# EAGLE design PentaBlinky (EAGLE 7.5.0)
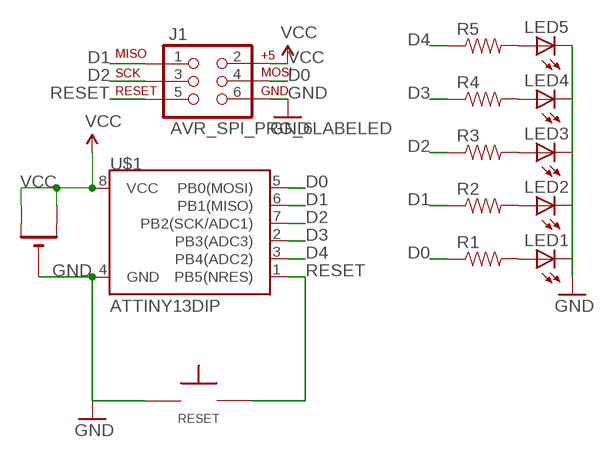
[diagram p0: schematic, sheet 1]

## Parts
J1  AVR_SPI_PRG_6LABELED  [2X3-NS]
LED1  LED5MM  [LED5MM]
LED2  LED5MM  [LED5MM]
LED3  LED5MM  [LED5MM]
LED4  LED5MM  [LED5MM]
LED5  LED5MM  [LED5MM]
R1  RESISTORAXIAL-0.3  [AXIAL-0.3]
R2  RESISTORAXIAL-0.3  [AXIAL-0.3]
R3  RESISTORAXIAL-0.3  [AXIAL-0.3]
R4  RESISTORAXIAL-0.3  [AXIAL-0.3]
R5  RESISTORAXIAL-0.3  [AXIAL-0.3]
RESET  SPST_NO  TAC_SPST_NO  [TAC_SPST_NO]
U$1  ATTINY13DIP  [DIP08]
U$4  BATT_GEN  [AA-AAA]

## Nets
D0: J1.4(MOSI) R1.P$1 U$1.5(PB0(MOSI))
D1: J1.1(MISO) R2.P$1 U$1.6(PB1(MISO))
D2: J1.3(SCK) R3.P$1 U$1.7(PB2(SCK/ADC1))
D3: R4.P$1 U$1.2(PB3(ADC3))
D4: R5.P$1 U$1.3(PB4(ADC2))
GND: J1.6(GND) LED1.K(C) LED2.K(C) LED3.K(C) LED4.K(C) LED5.K(C) RESET.P$1 U$1.4(GND) U$4.-
N$1: LED1.A R1.P$2
N$2: LED2.A R2.P$2
N$3: LED3.A R3.P$2
N$4: LED4.A R4.P$2
N$5: LED5.A R5.P$2
RESET: J1.5(RST) RESET.P$2 U$1.1(PB5(NRES))
VCC: J1.2(V+) U$1.8(VCC) U$4.+ U$4.++(+1)

## Library data of the parts
J1 = barbary_enterprises:AVR_SPI_PRG_6: AVR ISP 6 Pin This is the reduced ISP connector for AVR programming. Common on Arduino. This footprint will take up less PCB space and can be used with a 10-pin to 6-pin adapter such as SKU: BOB-08508
LED1-LED5 = SparkFun-LED:LED: LEDs Standard schematic elements and footprints for 5mm, 3mm, 1206, and 0603 sized LEDs. 5mm - Spark Fun Electronics SKU : COM-00529 (and others)
R1-R5 = SparkFun-Resistors:RESISTOR: Resistor Basic schematic elements and footprints for 0603, 1206, and PTH resistors.
RESET = barbary_enterprises:TAC_SPST_NO: 3,5 mm Tact Switches C&K PTS635 Series * Digi-Key Part Number: CKN9102-ND
U$1 = SparkFun-DigitalIC:ATTINY13: Atmel 8-pin 1kB flash uC
U$4 = battery:BATT_GEN

## Board
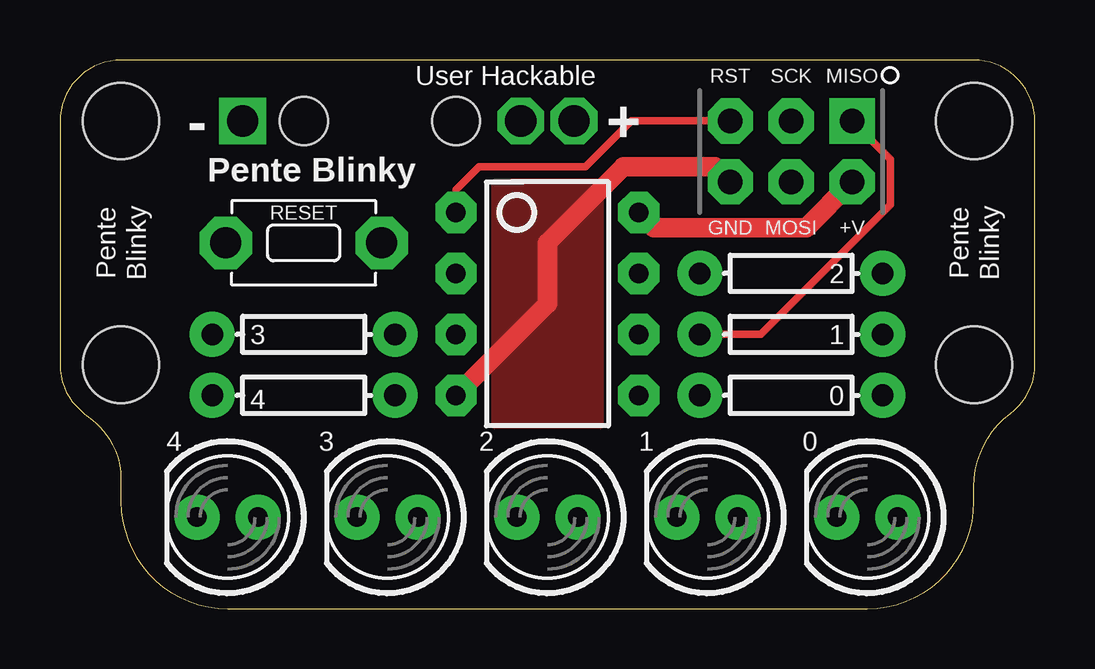
[diagram p1: board, top side]
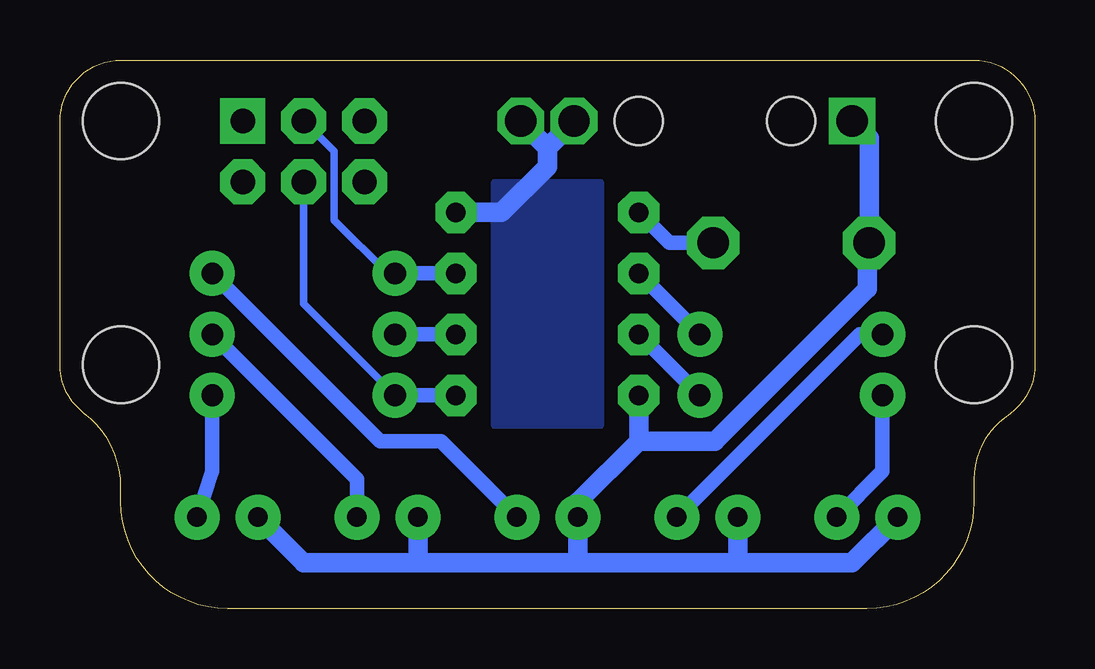
[diagram p2: board, bottom side, seen from below]

Size 40.64 x 22.86 mm. Coordinates in mm from the lower left corner, seen from the top.
Outline: 0,20.3 0,10.16 arc53 1.02,8.13 1.27,7.94 arc-53 2.54,5.4 2.54,4.46 arc90 7,0 33.66,0 arc90 38.1,4.45 38.1,5.08 arc-53 39.62,8.13 arc53 40.64,10.16 40.64,20.3 arc90 38.08,22.86 2.56,22.86 arc90 0,20.3
Copper layers (1*16): Top 0.0356mm / dielectric 1.5011mm / Bottom 0.0356mm
Design rules "LaenPCBOrder": minimum track width 6mil, minimum drill 13mil, track to track 6mil, track to pad 6mil, pad to pad 6mil, via to via 6mil, smd to smd 6mil, copper to edge 15mil, drill to drill 6mil, minimum pad ring 7mil, minimum via ring 7mil, stop-mask expansion 3mil, vias tented up to drill 0mil, thermal gap 10mil
Holes 3.17 mm at 2.54,20.32 2.54,10.16 38.1,10.16 38.1,20.32

### Footprints (pad centres in the part's own frame; a part is rotated, then mirrored left to right if it is on the bottom)
2X3-NS = drill 1.016 pad 1.88 square: 1 -2.54,-1.27 | drill 1.016 pad 1.88 octagon: 2 -2.54,1.27; 3 0,-1.27; 4 0,1.27; 5 2.54,-1.27; 6 2.54,1.27
LED5MM = drill 0.813 pad 1.88: A -1.27,0; K 1.27,0
AXIAL-0.3 = drill 0.9 pad 1.88: P$1 -3.81,0; P$2 3.81,0
TAC_SPST_NO = drill 1.3 pad 2.184 octagon: P$1 -3.251,0; P$2 3.251,0
DIP08 = drill 0.813 pad 1.727 octagon: 1 -3.81,-3.81; 2 -1.27,-3.81; 3 1.27,-3.81; 4 3.81,-3.81; 5 3.81,3.81; 6 1.27,3.81; 7 -1.27,3.81; 8 -3.81,3.81
AA-AAA = drill 1.3 pad 1.93 octagon: + 11.589,0; ++ 13.811,0 | drill 1.3 pad 1.93 square: - 0,0 | hole 2: 2.54,0; 8.89,0

### Placement (x,y rotation side)
J1  30.48,19.05 180 top
LED1  33.66,3.81 180 top
LED2  26.99,3.81 180 top
LED3  20.32,3.81 180 top
LED4  13.65,3.81 180 top
LED5  6.99,3.81 180 top
R1  30.48,8.89 0 top
R2  30.48,11.43 0 top
R3  30.48,13.97 0 top
R4  10.16,11.43 180 top
R5  10.16,8.89 180 top
RESET  10.16,15.24 0 top
U$1  20.32,12.7 270 top
U$4  7.62,20.32 0 top

### Tracks (layer width: path | path; a pad name or v marks a point on that pad's centre or on a via)
D0
  Bottom 0.305: J1.4 30.48,12.7 R1.P$1
  Bottom 0.61: U$1.5 R1.P$1
D1
  Top 0.305: J1.1 34.61,18.73 34.61,16.83 29.21,11.43 R2.P$1
  Bottom 0.61: U$1.6 R2.P$1
D2
  Bottom 0.305: J1.3 29.21,19.05 29.21,16.19 26.99,13.97 R3.P$1
  Bottom 0.61: U$1.7 R3.P$1
D3
  Bottom 0.61: U$1.2 R4.P$1
D4
  Bottom 0.61: U$1.3 R5.P$1
GND
  Top 0.813: U$1.4 20.32,12.7 20.32,15.24 23.5,18.41 27.3,18.41 J1.6
  Bottom 0.813: LED5.K 7.62,1.91 12.38,1.91 | U$1.4 16.51,6.99 | 16.51,6.99 13.34,6.99 6.99,13.34 6.99,15.24 RESET.P$1 6.91,19.61 U$4.- | 12.38,1.91 19.05,1.91 | 19.05,1.91 25.72,1.91 | 25.72,1.91 30.48,1.91 LED1.K | LED2.K 25.72,1.91 | 16.51,6.99 19.05,4.45 LED3.K 19.05,1.91 | LED4.K 12.38,1.91
  pour Top: 18.1,7.62 22.54,7.62 22.54,17.78 18.1,17.78
N$1
  Bottom 0.61: R1.P$2 34.29,5.71 LED1.A
N$2
  Bottom 0.61: LED2.A 28.26,5.4 R2.P$2
N$3
  Bottom 0.61: LED3.A 24.77,6.99 27.3,6.99 R3.P$2
N$4
  Bottom 0.61: R4.P$2 7.3,11.43 LED4.A
N$5
  Bottom 0.61: R5.P$2 6.35,5.71 LED5.A
RESET
  Top 0.305: J1.5 23.81,20.32 21.91,18.41 17.46,18.41 16.51,17.46 U$1.1
  Bottom 0.61: RESET.P$2 15.24,15.24 U$1.1
VCC
  Top 0.813: U$1.8 24.77,15.88 31.11,15.88 J1.2
  Bottom 0.813: U$4.+ 20.32,19.21 | U$1.8 22.23,16.51 20.32,18.41 20.32,19.21 | 20.32,19.21 U$4.++
  pour Bottom: 18.1,7.62 22.54,7.62 22.54,17.78 18.1,17.78

### Text on the board
tPlace: User Hackable | - | + | Pente Blinky | Pente | Blinky | Pente | Blinky | 2 | 3 | 1 | 4 | 0 | 4 | 3 | 2 | 1 | 0